# EAGLE design OrangeSqueezer (EAGLE 7.4.0)
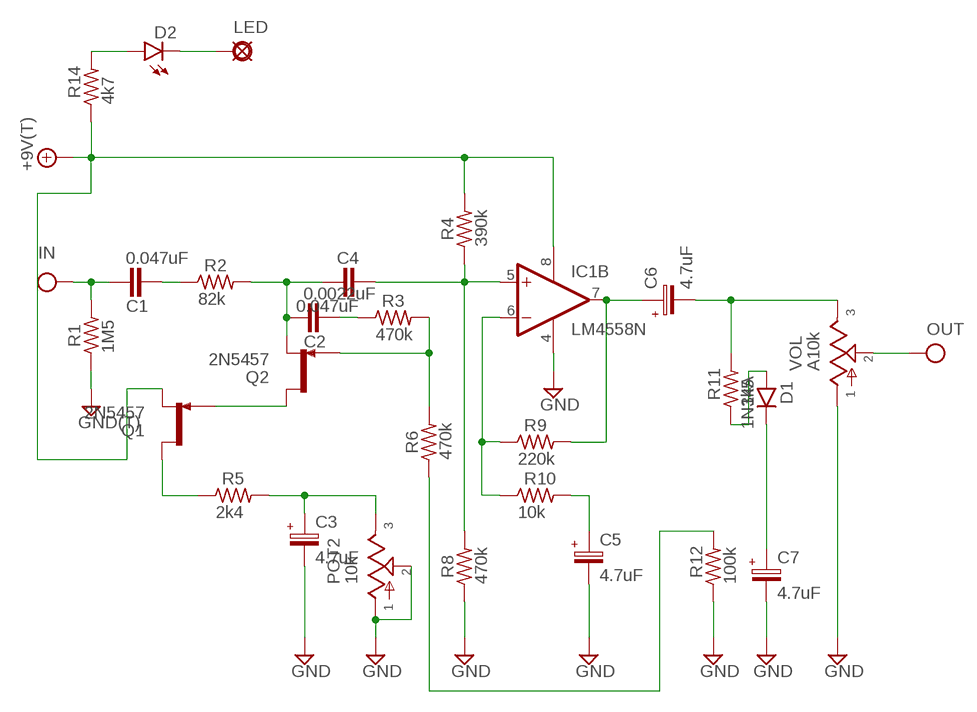
[diagram p0: schematic, sheet 1]

## Parts
+9V  +9V(T)  [SQUARE]
C1  0.047uF  072X0252  [072X025]
C2  0.0022uF  072X0252  [072X025]
C3  4.7uF  050-EU1  [050_020_1]
C4  0.047uF  072X0252  [072X025]
C5  4.7uF  050-EU1  [050_020_1]
C6  4.7uF  050-EU1  [050_020_1]
C7  4.7uF  050-EU1  [050_020_1]
D1  1N34A  1N400X.3  [DO41-3]
D2  LED3MM  [LED3MM]
G  GND(T)  [SQUARE]
IC1  LM4558N  [DIL08]
IN  IN(T)  [SQUARE]
LED  LED  PAD  [SQUARE]
OUT  OUT(T)  [SQUARE]
POT2  10k  POTTRIM  [B25P]
Q1  2N5457  [TO92-]
Q2  2N5457  [TO92-]
R1  1M5  6MM.3  [R0207/3]
R2  82k  6MM.3  [R0207/3]
R3  470k  6MM.3  [R0207/3]
R4  390k  6MM.3  [R0207/3]
R5  2k4  6MM.3  [R0207/3]
R6  470k  6MM.3  [R0207/3]
R8  470k  6MM.3  [R0207/3]
R9  220k  6MM.3  [R0207/3]
R10  10k  6MM.3  [R0207/3]
R11  1k5  6MM.3  [R0207/3]
R12  100k  6MM.3  [R0207/3]
R14  4k7  6MM.3  [R0207/3]
VOL  A10k  POT16MM_PCB_PADS  [16MM_PCB_PADS]

## Nets
+9V: +9V.1(+9V) IC1.8(P:V+) Q1.2(S) R4.2 R14.1
GND: C3.- C5.- C7.- G.1(GND) IC1.4(P:V-) POT2.1 POT2.2 R1.1 R8.1 R12.1 VOL.1
IN: C1.2 IN.1(IN) R1.2
N$1: C1.1 R2.1
N$2: Q1.3(D) R5.1
N$3: Q1.1(G) Q2.3(D)
N$4: IC1.6(B:-IN) R9.1 R10.1
N$5: C2.2 C4.1 Q2.2(S) R2.2
N$6: C2.1 R3.1
N$7: Q2.1(G) R3.2 R6.2
N$8: C3.+ POT2.3 R5.2
N$9: C4.2 IC1.5(B:+IN) R4.1 R8.2
N$11: C5.+ R10.2
N$12: C6.- R11.2 VOL.3
N$13: D1.A R11.1
N$14: C7.+ D1.C
N$15: D2.A R14.2
N$16: D2.K(C) LED.1(PAD)
N$17: R6.1 R12.2
N$18: C6.+ IC1.7(B:OUT) R9.2
OUT: OUT.1(OUT) VOL.2
Unconnected: IC1.1(A:OUT) IC1.2(A:-IN) IC1.3(A:+IN)

## Library data of the parts
+9V = mb_supply:+9V(T): +9V Voltage Supply use this to hook up +9v throughout a schematic instead of running wire automatically labels the net "+9v" adds a hookup pad to the circuit board
C1 C2 C4 = mb_caps-box:072X025: 1000pF - 0.47uF WIMA MKP2 63, 100V: 1000pF - 0.015uF; MKS2 50V: 0.33 - 0.47uF; 63V: 1000pF - 0.22uF;
C3 C5-C7 = mb_caps-electro:050-EU
D1 = mb_diodes:1N400X: Rectifier Diodes often used in power supply to prevent damage from reverse polarization
D2 = mb_diodes:LED
G = mb_supply:GND(T): Ground use this to hook up ground (GND) throughout a schematic instead of running wire automatically labels the net "GND" adds a hookup pad to the circuit board (you can use several)
IC1 = mb_ics:*4558: *4558 Op Amp Infamous for its use in tube screamers. This op amp has many manufacturers, hence the leading "*" in the name. The JRC4558 is a widely used example.
IN = mb_supply:IN(T): Input obsolete: use Pad instead and label net shematic input label with circuit board terminal/pad generally used only once on a schematic (because this device labels the net "IN" in the same way as a voltage supply or ground net)
LED = mb_supply:PAD: PAD use this package for pads with any purpose, including input, output, send or return various pad shapes: round, square, octogonal, long, and long offset
OUT = mb_supply:OUT(T): Output obsolete: use Pad instead and label net output label with circuit board terminal/pad usually appears only once on a schematic
POT2 VOL = mb_pots:POT: Potentiometers the arrow indicates the clockwise motion of th wiper (lug 2) fully counter clockwise there is no resistance between lugs 1 and 2 fully clockwise the resistance between lugs 1 and 2 is the value of the pot
Q1 Q2 = mb_trans:2N5457: N-CHANNEL JFET
R1-R6 R8-R12 R14 = mb_resistors:6MM: 6mm Resistors Leads spaced 1-6 holes apart for 0.1" perfboard. Suitable for 1/4 watt resistors.

## Board
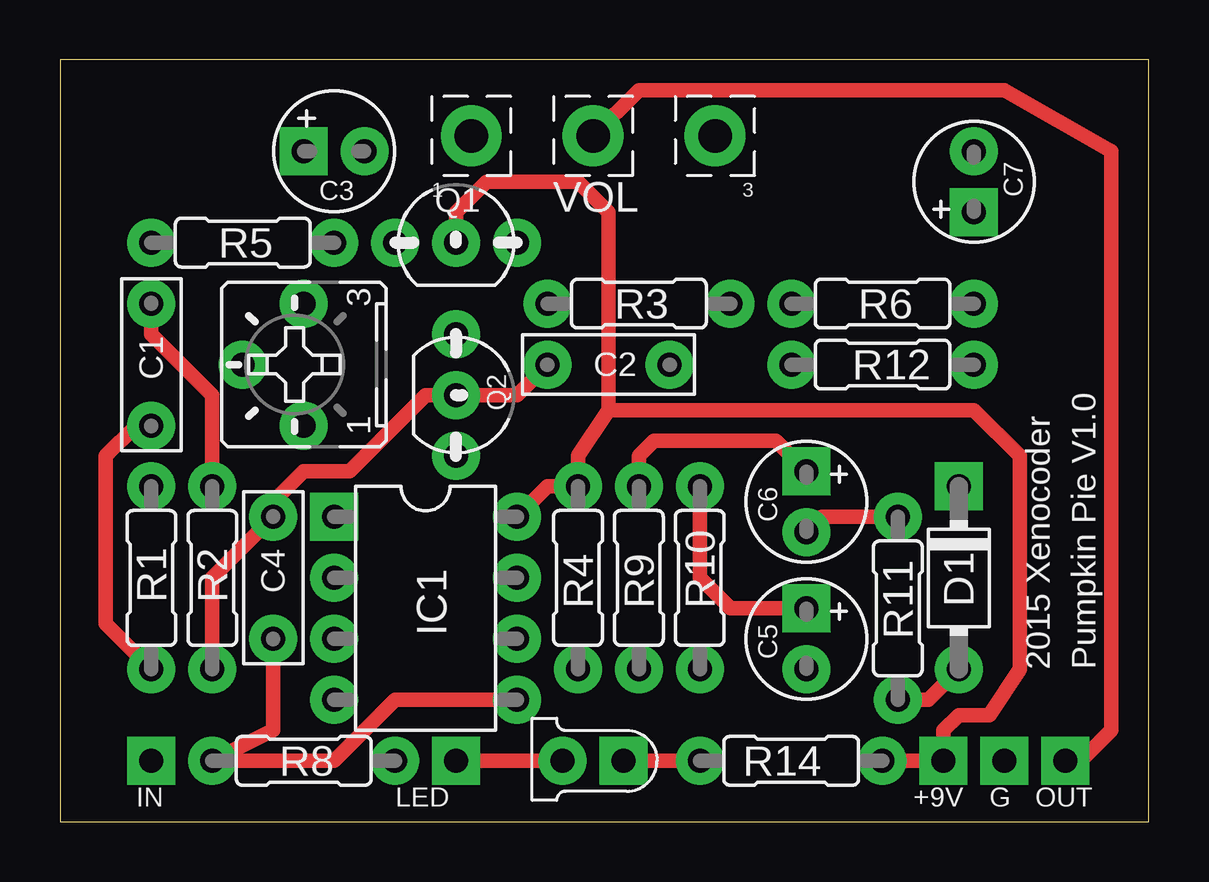
[diagram p1: board, top side]
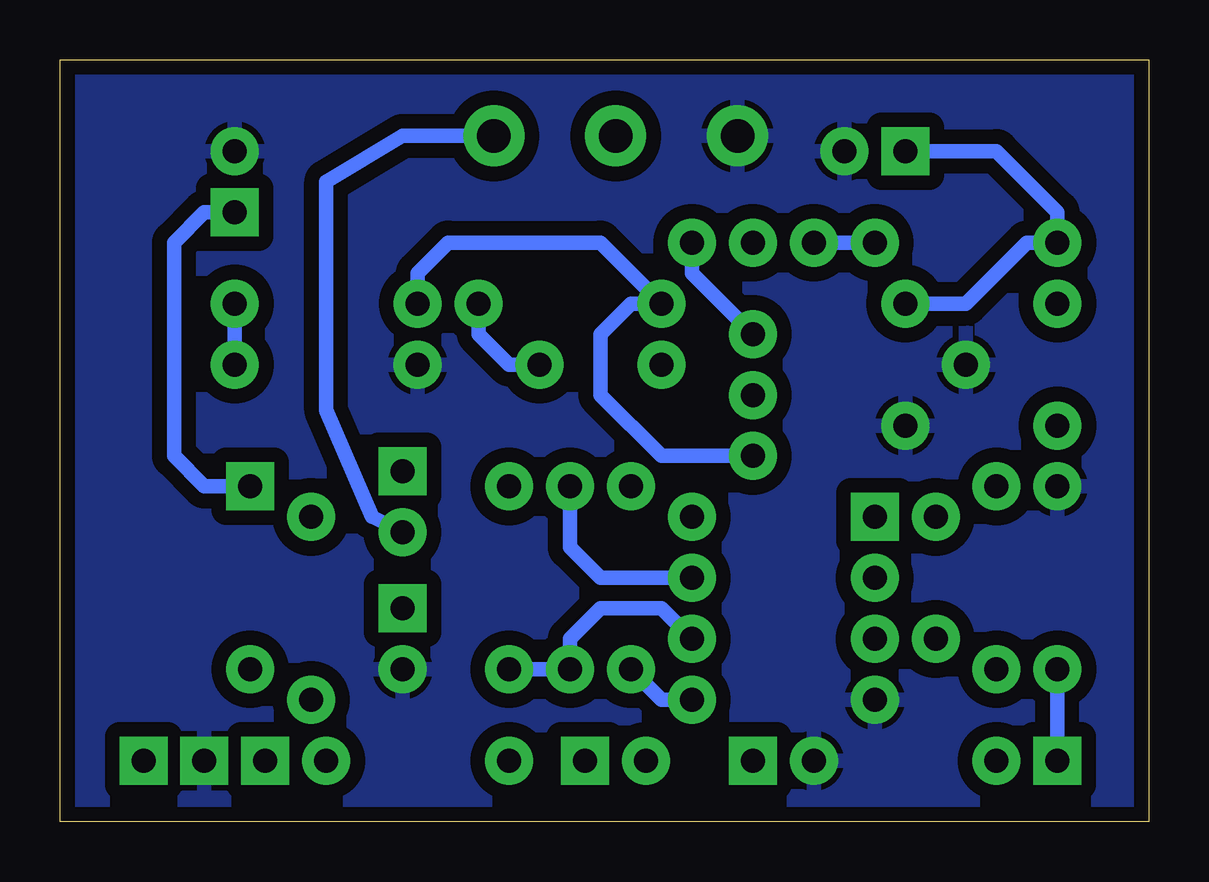
[diagram p2: board, bottom side, seen from below]

Size 45.39 x 31.74 mm. Coordinates in mm from the lower left corner, seen from the top.
Outline: 0,0 45.39,0 45.39,31.74 0,31.74 0,0
Copper layers (1*16): Top 0.0356mm / dielectric 1.5011mm / Bottom 0.0356mm
Design rules "LaenPCBOrder": minimum track width 6mil, minimum drill 13mil, track to track 6mil, track to pad 6mil, pad to pad 6mil, via to via 6mil, smd to smd 6mil, copper to edge 15mil, drill to drill 6mil, minimum pad ring 7mil, minimum via ring 7mil, stop-mask expansion 3mil, vias tented up to drill 0mil, thermal gap 10mil

### Footprints (pad centres in the part's own frame; a part is rotated, then mirrored left to right if it is on the bottom)
SQUARE = drill 1 pad 2 square: 1 0,0
072X025 = drill 1 pad 2: 1 -2.54,0; 2 2.54,0
050_020_1 = drill 1 pad 2 square: + -1.27,0 | drill 1 pad 2: - 1.27,0
DO41-3 = drill 1 pad 2: A 3.81,0 | drill 1 pad 2 square: C -3.81,0
LED3MM = drill 1 pad 2 square: A -1.27,0 | drill 1 pad 2: K 1.27,0
DIL08 = drill 1 pad 2 square: 1 -3.81,-3.81 | drill 1 pad 2: 2 -1.27,-3.81; 3 1.27,-3.81; 4 3.81,-3.81; 5 3.81,3.81; 6 1.27,3.81; 7 -1.27,3.81; 8 -3.81,3.81
B25P = drill 1 pad 2: 1 -2.54,0; 2 0,2.54; 3 2.54,0
TO92- = drill 1 pad 2: 1 2.54,0; 2 0,0; 3 -2.54,0
R0207/3 = drill 1 pad 2: 1 -3.81,0; 2 3.81,0
16MM_PCB_PADS = drill 1.4 pad 2.54: 1 5.08,0; 2 0,0; 3 -5.08,0

### Placement (x,y rotation side)
+9V  36.83,2.54 0 top
C1  3.81,19.05 270 top
C2  22.86,19.05 180 top
C3  11.43,27.94 0 top
C4  8.89,10.16 270 top
C5  31.11,7.62 270 top
C6  31.11,13.34 270 top
C7  38.1,26.67 90 top
D1  37.47,10.16 270 top
D2  22.23,2.54 180 top
G  39.37,2.54 0 top
IC1  15.24,8.89 270 top
IN  3.81,2.54 0 top
LED  16.51,2.54 0 top
OUT  41.91,2.54 0 top
POT2  10.16,19.05 90 top
Q1  16.51,24.13 0 top
Q2  16.51,17.78 270 top
R1  3.81,10.16 270 top
R2  6.35,10.16 270 top
R3  24.13,21.59 180 top
R4  21.59,10.16 90 top
R5  7.62,24.13 180 top
R6  34.29,21.59 180 top
R8  10.16,2.54 180 top
R9  24.13,10.16 90 top
R10  26.67,10.16 90 top
R11  34.92,8.89 90 top
R12  34.29,19.05 0 top
R14  30.48,2.54 180 top
VOL  22.23,28.57 180 top

### Tracks (layer width: path | path; a pad name or v marks a point on that pad's centre or on a via)
+9V
  Top 0.61: R14.1 +9V.1 36.83,3.81 37.47,4.45 38.73,4.45 40.01,6.35 40.01,15.24 38.1,17.14 22.86,17.14 | 22.86,17.14 21.59,15.24 R4.2 20.32,13.97 IC1.8 | Q1.2 16.51,25.4 17.78,26.67 21.59,26.67 22.86,25.4 22.86,17.14
GND
  pour Bottom (isolate 0.61): 0,31.75 45.72,31.75 45.72,0 0,0
IN
  Top 0.61: R1.2 1.91,8.26 1.91,15.24 3.17,16.51 C1.2
  Bottom 0.61: IN.1 R1.2
N$1
  Top 0.61: R2.1 6.35,17.78 3.81,20.32 C1.1
N$2
  Bottom 0.61: R5.1 Q1.3
N$3
  Bottom 0.61: Q2.3 19.05,22.86 Q1.1
N$4
  Bottom 0.61: IC1.6 20.32,8.89 22.86,8.89 24.13,7.62 R9.1 R10.1
N$5
  Top 0.61: R2.2 6.35,10.16 C4.1 8.89,13.34 10.16,14.61 12.06,14.61 15.24,17.78 Q2.2 19.05,17.78 C2.2
N$6
  Bottom 0.61: C2.1 26.67,19.05 27.94,20.32 R3.1
N$7
  Bottom 0.61: Q2.1 20.32,15.24 22.86,17.78 22.86,20.32 21.59,21.59 R3.2 22.86,24.13 29.21,24.13 30.48,22.86 R6.2
N$8
  Bottom 0.61: POT2.3 7.62,21.59 5.08,24.13 R5.2 3.81,25.4 6.35,27.94 C3.+
N$9
  Top 0.61: C4.2 8.89,3.81 R8.2 11.43,2.54 13.97,5.08 IC1.5
  Bottom 0.61: IC1.5 20.32,5.08 R4.1
N$11
  Top 0.61: C5.+ 27.94,8.89 26.67,10.16 R10.2
N$12
  Top 0.61: R11.2 31.75,12.7 C6.-
  Bottom 0.61: C6.- 32.38,12.7 34.29,17.14 34.29,26.67 31.11,28.57 VOL.3
N$13
  Top 0.61: R11.1 36.2,5.08 D1.A
N$14
  Bottom 0.61: D1.C 39.37,13.97 40.64,15.24 40.64,24.13 39.37,25.4 C7.+
N$15
  Top 0.61: R14.2 D2.A
N$16
  Top 0.61: D2.K LED.1
N$17
  Bottom 0.61: R6.1 R12.2
N$18
  Top 0.61: R9.2 24.13,15.24 24.77,15.88 29.84,15.88 C6.+
  Bottom 0.61: C6.+ 30.48,15.24 | IC1.7 22.86,10.16 24.13,11.43 R9.2
OUT
  Top 0.61: VOL.2 24.13,30.48 39.37,30.48 43.81,27.94 43.81,3.81 42.55,2.54 OUT.1

### Text on the board
tNames: 2015 Xenocoder | Pumpkin Pie V1.0